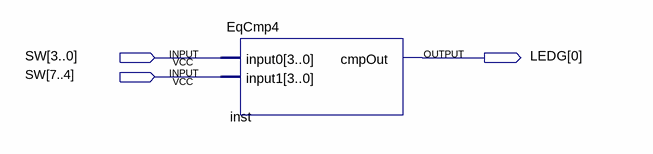
[diagram p0: schematic sheet]
// Quartus schematic EqCmpDemo.bdf as structural Verilog: 1 symbols, 3 pins
module EqCmpDemo (
  input  [7:0] SW,
  output [0:0] LEDG
);

  EqCmp4 inst (.input0(SW[3:0]), .input1(SW[7:4]), .cmpOut(LEDG[0]));
endmodule
